# EAGLE schematic PPS_schematic (EAGLE 9.6.2)
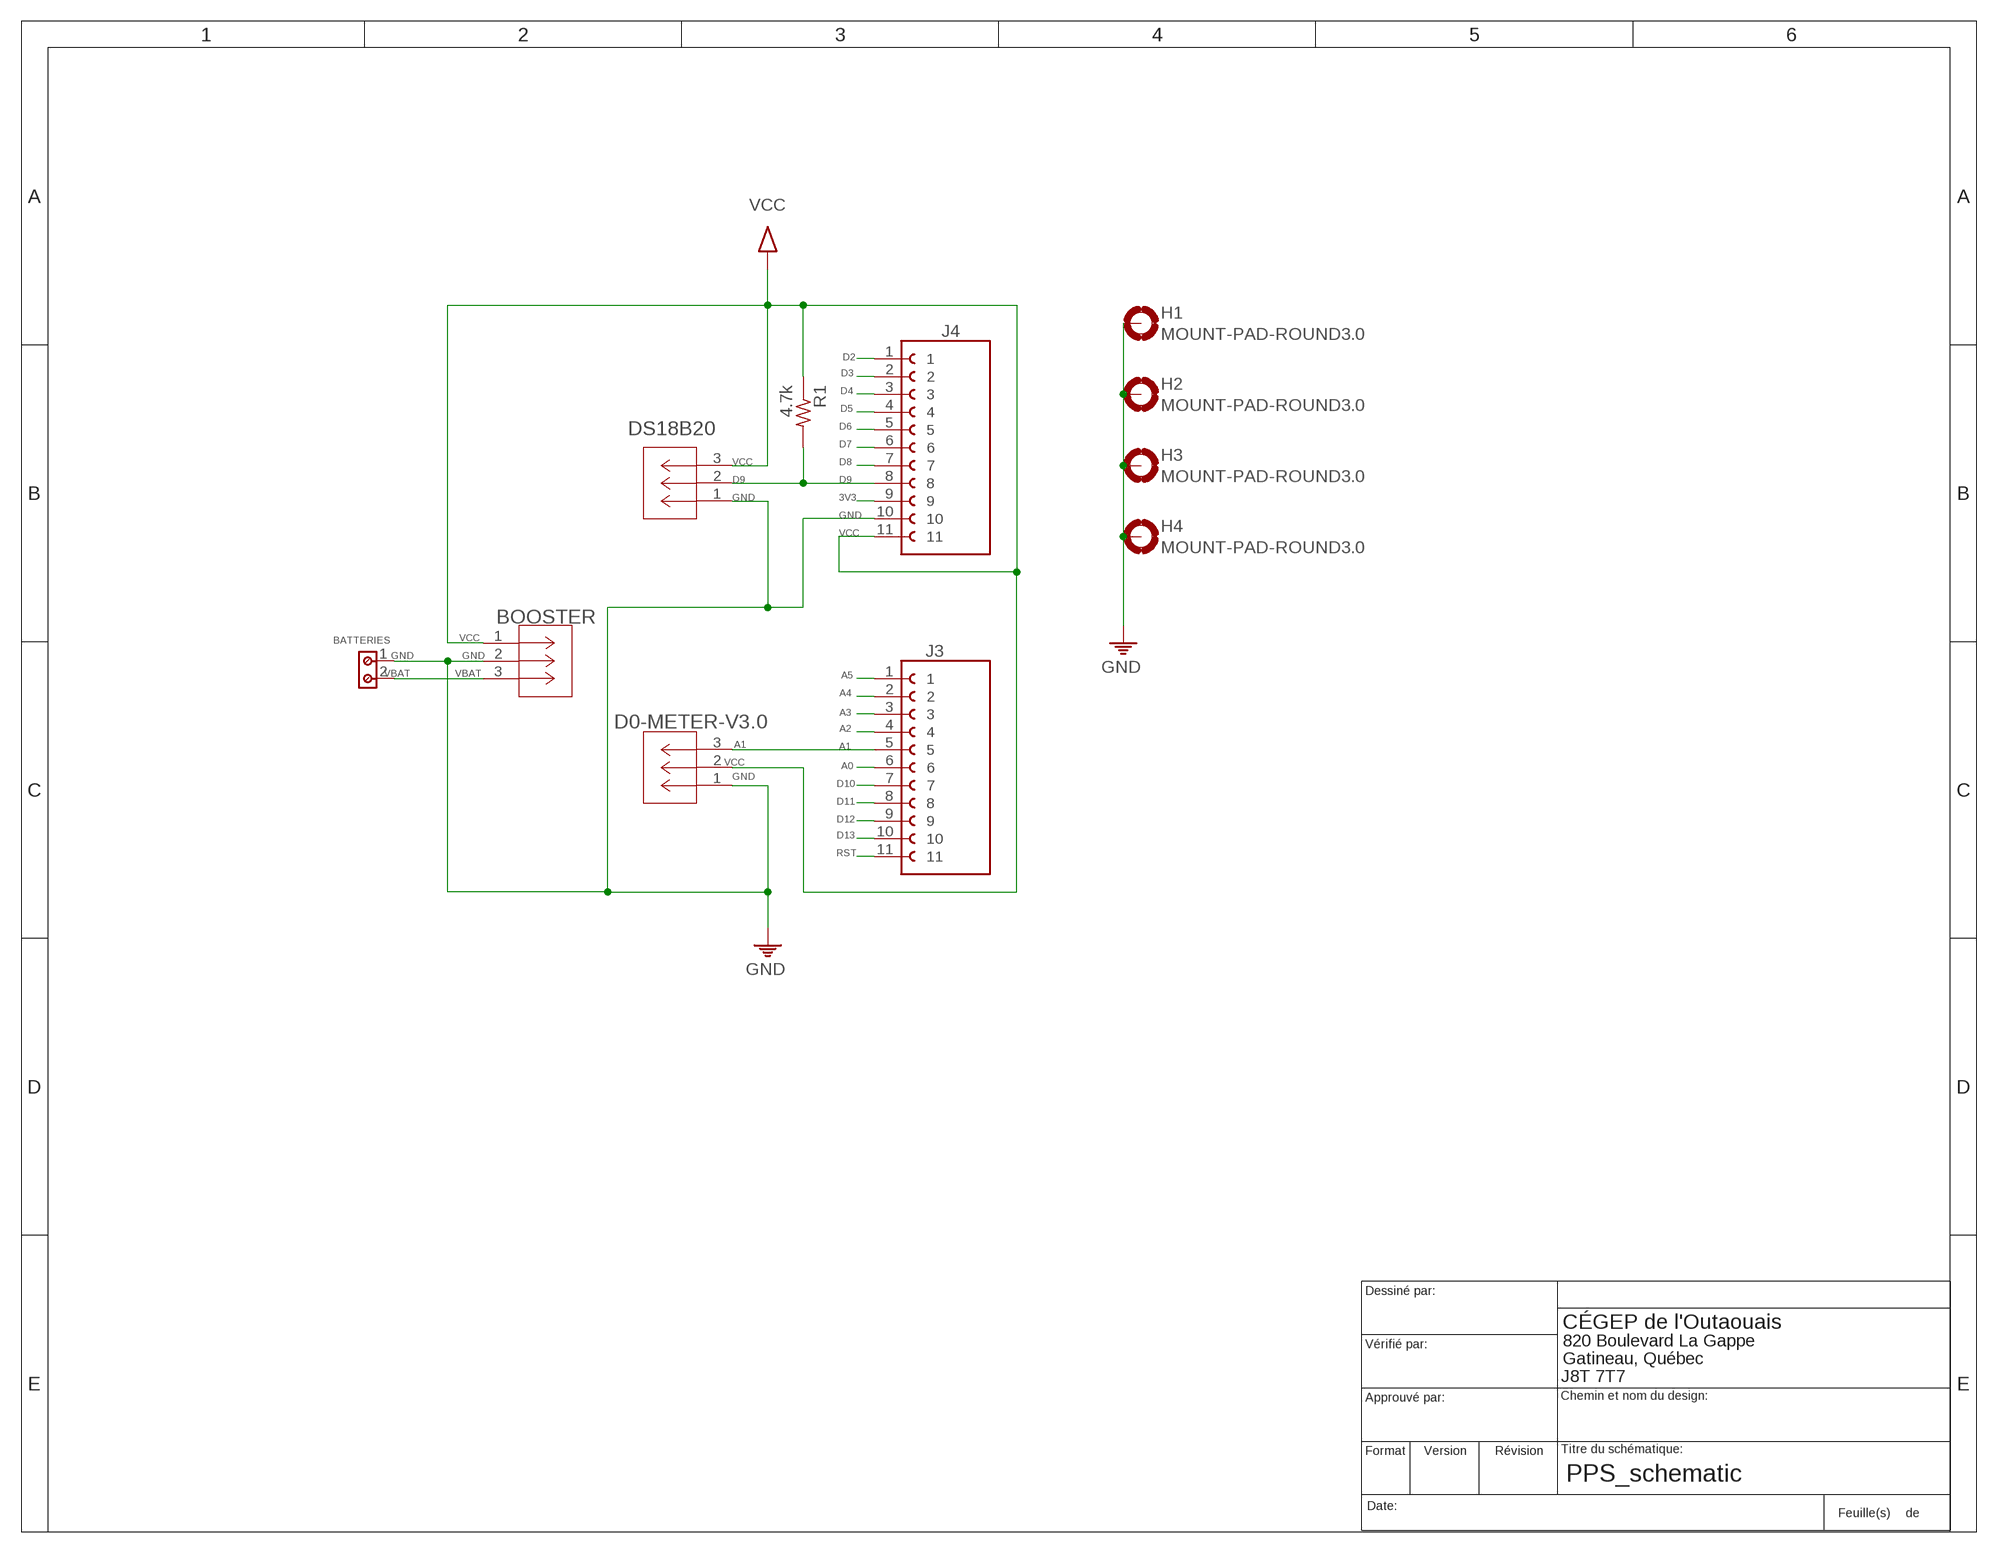
[diagram p0: schematic, sheet 1]

## Parts
BATTERIES  691137710002  691137710002  [691137710002]
BOOSTER  TS-103-T-ACON3_1X3_TU_HTS_SAI  [CON3_1X3_TU_HTS_SAI]
D0-METER-V3.0  PPTC031LFBN-RCCONN_PPTC031_SUL  [CONN_PPTC031_SUL]
DS18B20  PPTC031LFBN-RCCONN_PPTC031_SUL  [CONN_PPTC031_SUL]
H1  MOUNT-PAD-ROUND3.0  [3,0-PAD]
H2  MOUNT-PAD-ROUND3.0  [3,0-PAD]
H3  MOUNT-PAD-ROUND3.0  [3,0-PAD]
H4  MOUNT-PAD-ROUND3.0  [3,0-PAD]
J3  M20-7821146  [HARWIN_M20-7821146]
J4  M20-7821146  [HARWIN_M20-7821146]
R1  4.7k  RM1206  [M1206]

## Nets
3V3: J4.9
A0: J3.6
A1: D0-METER-V3.0.3 J3.5
A2: J3.4
A3: J3.3
A4: J3.2
A5: J3.1
D2: J4.1
D3: J4.2
D4: J4.3
D5: J4.4
D6: J4.5
D7: J4.6
D8: J4.7
D9: DS18B20.2 J4.8 R1.2
D10: J3.7
D11: J3.8
D12: J3.9
D13: J3.10
GND: BATTERIES.1 BOOSTER.2 D0-METER-V3.0.1 DS18B20.1 H1.B3,0(MOUNT) H2.B3,0(MOUNT) H3.B3,0(MOUNT) H4.B3,0(MOUNT) J4.10
RST: J3.11
VBAT: BATTERIES.2 BOOSTER.3
VCC: BOOSTER.1 D0-METER-V3.0.2 DS18B20.3 J4.11 R1.1

## Library data of the parts
BATTERIES = 691137710002:691137710002: WR-TBL Serie 1377 - 5.00 mm Horiz Entry w. Pressure Clamp Glow Wire KIND PROPERTIES Pitch 5 mm MATERIAL PROPERTIES Insulator Material PA6/66 Insulator Flammability Rating UL94 V-0 Insulator Color Green Contact Material Copper Alloy Contact Plating Tin over Nickel Terminal Screw Material Steel Terminal Screw Plating Zinc Wire Guard Material Copper Alloy with Tin GENERAL INFORMATION Operating Temperature -30 up to +120 °C Compliance Lead free / RoHS ELECTRICAL PROPERTIES IR UL 16 A IR VDE 24 A Working Voltage [UL] 300 V (AC) Working Voltage [VDE] 250 V (AC) Withstanding Voltage [UL] 1600 V (AC) Withstanding Voltage [VDE] 2000 V (AC) Contact Resistance 20 mΩ Contact Resistance [UL] 20 mΩ Contact Resistance [VDE] 20 mΩ MECHANICAL PROPERTIES Wire Strip Length 6 (mm) Screw M2.5 Solid Wire Section (AWG) 12 to 30 (AWG) Solid Wire Section (Metric) 3.31 to 0.05 (mm) Stranded Wire Section (AWG) 12 to 30 (AWG) Stranded Wire Section (Metric) 3.31 to 0.05 (mm) CERTIFICATION UL Approval E150931 VDE Approval 40021397 PACKAGING PROPERTIES Packaging Box <https://katalog.we-online.com/media/images/v2/o84014v209%20Family_WR-TBL1_6911377100xx.jpg> Details see: https://katalog.we-online.com/en/em/TBL_5_00_1377_HORIZONTAL_ENTRY_W_PRESSURE_CLAMP_GLOW_WIRE_6911377100xx Updated by Ella Wu 2019-11-08 2019(C) Wurth Elektronik; DATASHEET-URL: https://www.we-online.com/catalog/datasheet/691137710002.pdf; IR-UL: 16A; IR-VDE: 24A; MOUNT: THT; PART-NUMBER: 691137710002; PINS: 2; PITCH: 5mm; TYPE: Horizontal; WIRE: 12 to 30 (AWG) 3.31 to 0.05 (mm²); WORKING-VOLTAGE-UL: 300V(AC); WORKING-VOLTAGE-VDE: 250V(AC)
BOOSTER = 2024-10-23_16-09-23_Library:TS-103-T-A; COPYRIGHT: Copyright (C) 2024 Ultra Librarian. All rights reserved.; MANUFACTURER_PART_NUMBER: TS-103-T-A; MFR_NAME: Samtec Inc
D0-METER-V3.0 DS18B20 = 2024-10-23_16-02-51_Library:PPTC031LFBN-RC; COPYRIGHT: Copyright (C) 2024 Ultra Librarian. All rights reserved.; MANUFACTURER_PART_NUMBER: PPTC031LFBN-RC; MFR_NAME: Sullins
H1-H4 = holes:MOUNT-PAD-ROUND: MOUNTING PAD, round
J3 J4 = M20-7821146:M20-7821146; MANUFACTURER: HARWIN; STANDARD: Manufacturer Recommendations
R1 = 1_TGE:R: R